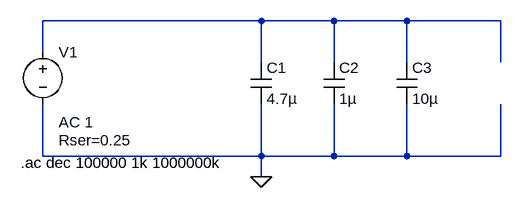
[diagram p0: schematic filter_rxsm.asc]
filter_rxsm.asc, the LTspice schematic file:
Version 4
SHEET 1 880 680
WIRE 352 96 16 96
WIRE 464 96 352 96
WIRE 576 96 464 96
WIRE 720 96 576 96
WIRE 16 144 16 96
WIRE 352 160 352 96
WIRE 464 160 464 96
WIRE 576 160 576 96
WIRE 720 160 720 96
WIRE 16 304 16 224
WIRE 352 304 352 224
WIRE 352 304 16 304
WIRE 464 304 464 224
WIRE 464 304 352 304
WIRE 576 304 576 224
WIRE 576 304 464 304
WIRE 720 304 720 224
WIRE 720 304 576 304
WIRE 352 336 352 304
FLAG 352 336 0
SYMBOL voltage 16 128 R0
WINDOW 123 24 124 Left 2
WINDOW 39 24 152 Left 2
SYMATTR InstName V1
SYMATTR Value ""
SYMATTR Value2 AC 1
SYMATTR SpiceLine Rser=0.25
SYMBOL cap 448 160 R0
SYMATTR InstName C2
SYMATTR Value 1µ
SYMATTR SpiceLine V=10 Irms=0 Rser=0.0078 Lser=1n
SYMBOL cap 560 160 R0
SYMATTR InstName C3
SYMATTR Value 10µ
SYMATTR SpiceLine V=25 Irms=0 Rser=0.002417 Lser=3n
SYMBOL cap 336 160 R0
SYMATTR InstName C1
SYMATTR Value 4.7µ
SYMATTR SpiceLine V=25 Irms=0 Rser=0.003494 Lser=1n
TEXT -18 314 Left 2 !.ac dec 100000 1k 1000000k

The netlist it stands for:
* filter_rxsm.asc
V1 N001 0 AC 1 Rser=0.25
C2 N001 0 1µ V=10 Irms=0 Rser=0.0078 Lser=1n
C3 N001 0 10µ V=25 Irms=0 Rser=0.002417 Lser=3n
C1 N001 0 4.7µ V=25 Irms=0 Rser=0.003494 Lser=1n
.ac dec 100000 1k 1000000k
.backanno
.end